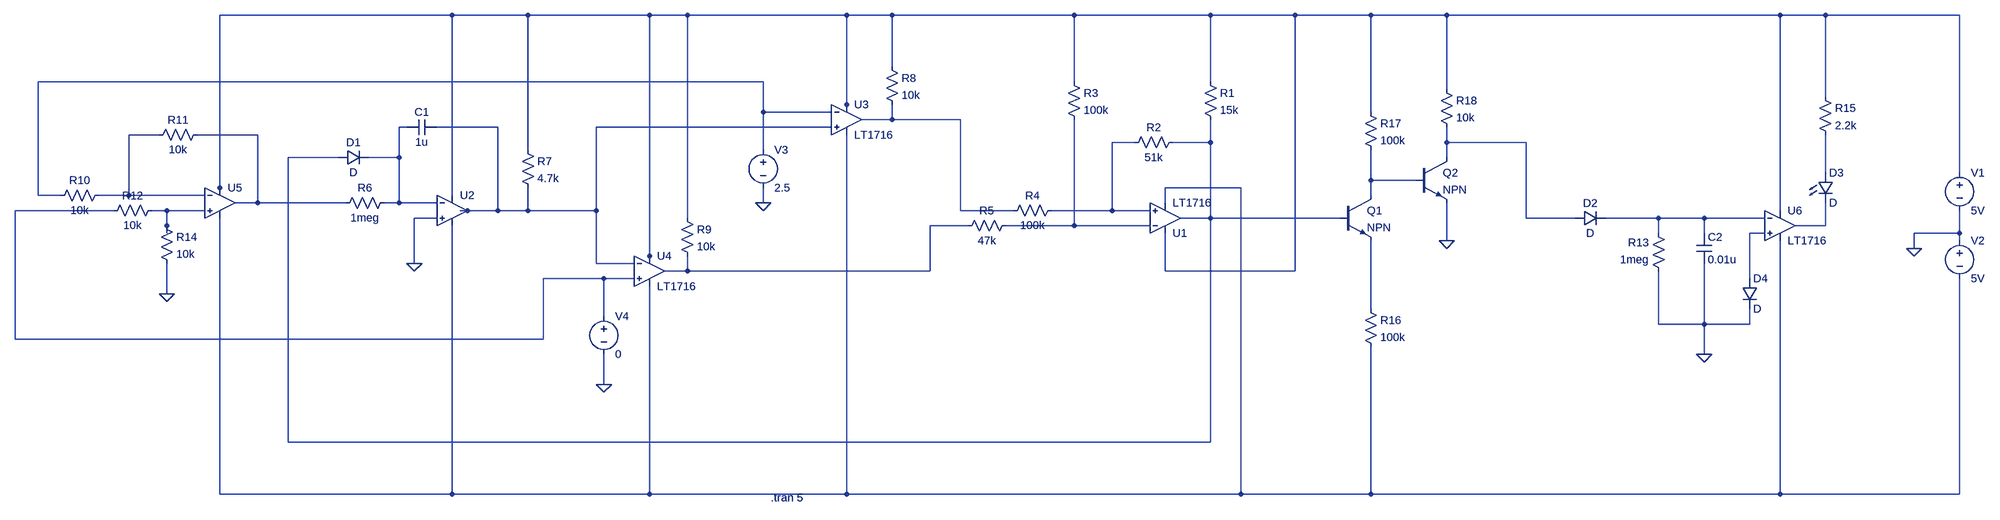
[diagram p0: schematic Sweep Generator.asc]
Sweep Generator.asc, the LTspice schematic file:
Version 4
SHEET 1 2540 920
WIRE -1040 -448 -1600 -448
WIRE -880 -448 -1040 -448
WIRE -624 -448 -880 -448
WIRE -544 -448 -624 -448
WIRE -208 -448 -544 -448
WIRE -112 -448 -208 -448
WIRE 272 -448 -112 -448
WIRE 560 -448 272 -448
WIRE 768 -448 560 -448
WIRE 928 -448 768 -448
WIRE 1088 -448 928 -448
WIRE 1936 -448 1088 -448
WIRE 2032 -448 1936 -448
WIRE 2480 -448 2032 -448
WIRE -112 -144 -112 -448
WIRE -384 -112 -1984 -112
WIRE 272 -112 272 -448
WIRE 560 -112 560 -448
WIRE 1088 -96 1088 -448
WIRE 2032 -80 2032 -448
WIRE -208 -64 -208 -448
WIRE -384 -48 -384 -112
WIRE -240 -48 -384 -48
WIRE -208 -48 -208 -64
WIRE 928 -48 928 -448
WIRE -112 -32 -112 -64
WIRE -112 -32 -176 -32
WIRE 32 -32 -112 -32
WIRE -1136 -16 -1152 -16
WIRE -944 -16 -1072 -16
WIRE -240 -16 -736 -16
WIRE -1728 0 -1792 0
WIRE -1520 0 -1648 0
WIRE 400 16 352 16
WIRE 560 16 560 -32
WIRE 560 16 480 16
WIRE 1088 16 1088 -16
WIRE 1312 16 1088 16
WIRE -880 32 -880 -448
WIRE -384 32 -384 -48
WIRE -1280 48 -1456 48
WIRE -1152 48 -1152 -16
WIRE -1152 48 -1216 48
WIRE 1088 48 1088 16
WIRE 2032 80 2032 0
WIRE 2480 80 2480 -448
WIRE 928 96 928 32
WIRE 1024 96 928 96
WIRE -1600 112 -1600 -448
WIRE 624 112 464 112
WIRE -1984 128 -1984 -112
WIRE -1936 128 -1984 128
WIRE -1792 128 -1792 0
WIRE -1792 128 -1856 128
WIRE -1632 128 -1792 128
WIRE -1600 128 -1600 112
WIRE -1040 128 -1040 -448
WIRE 928 128 928 96
WIRE -1520 144 -1520 0
WIRE -1520 144 -1568 144
WIRE -1264 144 -1520 144
WIRE -1152 144 -1152 48
WIRE -1152 144 -1184 144
WIRE -1072 144 -1152 144
WIRE -384 144 -384 112
WIRE 464 144 464 112
WIRE -1824 160 -2032 160
WIRE -1712 160 -1744 160
WIRE -1632 160 -1712 160
WIRE -1008 160 -1024 160
WIRE -944 160 -944 -16
WIRE -944 160 -1008 160
WIRE -880 160 -880 112
WIRE -880 160 -944 160
WIRE -736 160 -736 -16
WIRE -736 160 -880 160
WIRE 32 160 32 -32
WIRE 144 160 32 160
WIRE 352 160 352 16
WIRE 352 160 224 160
WIRE 432 160 352 160
WIRE 1936 160 1936 -448
WIRE -1072 176 -1120 176
WIRE -544 176 -544 -448
WIRE 560 176 560 16
WIRE 560 176 496 176
WIRE 864 176 560 176
WIRE 1312 176 1312 16
WIRE 1504 176 1312 176
WIRE 1680 176 1568 176
WIRE 1776 176 1680 176
WIRE 1904 176 1776 176
WIRE -1712 192 -1712 160
WIRE 48 192 -32 192
WIRE 272 192 272 -32
WIRE 272 192 128 192
WIRE 432 192 272 192
WIRE 2032 192 2032 144
WIRE 2032 192 1968 192
WIRE -1712 208 -1712 192
WIRE 1680 208 1680 176
WIRE 1776 208 1776 176
WIRE 1904 208 1872 208
WIRE 2480 208 2480 160
WIRE 2480 208 2384 208
WIRE 1088 224 1088 144
WIRE 2480 224 2480 208
WIRE 2384 240 2384 208
WIRE -624 256 -624 -448
WIRE -1120 272 -1120 176
WIRE -736 272 -736 160
WIRE -656 272 -736 272
WIRE -624 272 -624 256
WIRE -544 288 -544 256
WIRE -544 288 -592 288
WIRE -32 288 -32 192
WIRE -32 288 -544 288
WIRE 464 288 464 208
WIRE 768 288 768 -448
WIRE 768 288 464 288
WIRE -720 304 -848 304
WIRE -656 304 -720 304
WIRE 1872 304 1872 208
WIRE -1712 336 -1712 272
WIRE 928 368 928 224
WIRE -720 384 -720 304
WIRE 1680 400 1680 288
WIRE 1776 400 1776 272
WIRE 1776 400 1680 400
WIRE 1872 400 1872 368
WIRE 1872 400 1776 400
WIRE -2032 432 -2032 160
WIRE -848 432 -848 304
WIRE -848 432 -2032 432
WIRE 1776 464 1776 400
WIRE -720 528 -720 464
WIRE -1456 688 -1456 48
WIRE 560 688 560 176
WIRE 560 688 -1456 688
WIRE -1600 896 -1600 176
WIRE -1040 896 -1040 192
WIRE -1040 896 -1600 896
WIRE -624 896 -624 320
WIRE -624 896 -1040 896
WIRE -208 896 -208 0
WIRE -208 896 -624 896
WIRE 624 896 624 112
WIRE 624 896 -208 896
WIRE 928 896 928 448
WIRE 928 896 624 896
WIRE 1936 896 1936 224
WIRE 1936 896 928 896
WIRE 2480 896 2480 304
WIRE 2480 896 1936 896
FLAG 2384 240 0
FLAG -384 144 0
FLAG -720 528 0
FLAG -1120 272 0
FLAG -1712 336 0
FLAG 1088 224 0
FLAG 1776 464 0
SYMBOL voltage 2480 64 R0
WINDOW 123 0 0 Left 0
WINDOW 39 0 0 Left 0
SYMATTR InstName V1
SYMATTR Value 5V
SYMBOL voltage 2480 208 R0
WINDOW 123 0 0 Left 0
WINDOW 39 0 0 Left 0
SYMATTR InstName V2
SYMATTR Value 5V
SYMBOL res 544 -128 R0
SYMATTR InstName R1
SYMATTR Value 15k
SYMBOL res 240 144 R90
WINDOW 0 0 56 VBottom 0
WINDOW 3 32 56 VTop 0
SYMATTR InstName R4
SYMATTR Value 100k
SYMBOL res 144 176 R90
WINDOW 0 0 56 VBottom 0
WINDOW 3 32 56 VTop 0
SYMATTR InstName R5
SYMATTR Value 47k
SYMBOL res 496 0 R90
WINDOW 0 0 56 VBottom 0
WINDOW 3 32 56 VTop 0
SYMATTR InstName R2
SYMATTR Value 51k
SYMBOL res 256 -128 R0
SYMATTR InstName R3
SYMATTR Value 100k
SYMBOL Comparators\\LT1716 464 176 M180
SYMATTR InstName U1
SYMBOL res -1168 128 R90
WINDOW 0 0 56 VBottom 0
WINDOW 3 32 56 VTop 0
SYMATTR InstName R6
SYMATTR Value 1meg
SYMBOL cap -1072 -32 R90
WINDOW 0 0 32 VBottom 0
WINDOW 3 32 32 VTop 0
SYMATTR InstName C1
SYMATTR Value 1u
SYMBOL res -896 16 R0
SYMATTR InstName R7
SYMATTR Value 4.7k
SYMBOL Comparators\\LT1716 -208 -32 R0
SYMATTR InstName U3
SYMBOL Comparators\\LT1716 -624 288 R0
SYMATTR InstName U4
SYMBOL res -128 -160 R0
SYMATTR InstName R8
SYMATTR Value 10k
SYMBOL res -560 160 R0
SYMATTR InstName R9
SYMATTR Value 10k
SYMBOL voltage -384 16 R0
WINDOW 123 0 0 Left 0
WINDOW 39 0 0 Left 0
SYMATTR InstName V3
SYMATTR Value 2.5
SYMBOL voltage -720 368 R0
WINDOW 123 0 0 Left 0
WINDOW 39 0 0 Left 0
SYMATTR InstName V4
SYMATTR Value 0
SYMBOL Opamps\\UniversalOpamp2 -1600 144 R0
SYMATTR InstName U5
SYMBOL res -1840 112 R90
WINDOW 0 0 56 VBottom 0
WINDOW 3 32 56 VTop 0
SYMATTR InstName R10
SYMATTR Value 10k
SYMBOL res -1632 -16 R90
WINDOW 0 0 56 VBottom 0
WINDOW 3 32 56 VTop 0
SYMATTR InstName R11
SYMATTR Value 10k
SYMBOL res -1728 144 R90
WINDOW 0 0 56 VBottom 0
WINDOW 3 32 56 VTop 0
SYMATTR InstName R12
SYMATTR Value 10k
SYMBOL Opamps\\UniversalOpamp2 -1040 160 R0
SYMATTR InstName U2
SYMBOL res -1728 176 R0
SYMATTR InstName R14
SYMATTR Value 10k
SYMBOL diode -1280 32 M90
WINDOW 0 0 32 VBottom 0
WINDOW 3 32 32 VTop 0
SYMATTR InstName D1
SYMBOL Comparators\\LT1716 1936 192 R0
SYMATTR InstName U6
SYMBOL cap 1760 208 R0
SYMATTR InstName C2
SYMATTR Value 0.01u
SYMBOL res 1696 304 R180
WINDOW 0 36 76 Left 0
WINDOW 3 36 40 Left 0
SYMATTR InstName R13
SYMATTR Value 1meg
SYMBOL res 2016 -96 R0
SYMATTR InstName R15
SYMATTR Value 2.2k
SYMBOL LED 2016 80 R0
SYMATTR InstName D3
SYMBOL diode 1504 160 M90
WINDOW 0 0 32 VBottom 0
WINDOW 3 32 32 VTop 0
SYMATTR InstName D2
SYMBOL diode 1856 304 R0
SYMATTR InstName D4
SYMBOL res 912 352 R0
SYMATTR InstName R16
SYMATTR Value 100k
SYMBOL res 912 -64 R0
SYMATTR InstName R17
SYMATTR Value 100k
SYMBOL npn 864 128 R0
SYMATTR InstName Q1
SYMBOL npn 1024 48 R0
SYMATTR InstName Q2
SYMBOL res 1072 -112 R0
SYMATTR InstName R18
SYMATTR Value 10k
TEXT -368 904 Left 0 !.tran 5

The netlist it stands for:
* Sweep Generator.asc
V1 N001 0 5V
V2 0 N013 5V
R1 N001 N009 15k
R4 N008 N003 100k
R5 N018 N017 47k
R2 N009 N008 51k
R3 N001 N018 100k
XU1 N008 N018 N001 N013 N009 LT1716  ; pins In+ In- V+ V- OUT
R6 N004 N007 1meg
C1 N005 N004 1u
R7 N001 N005 4.7k
XU3 N005 N002 N001 N013 N003 LT1716  ; pins In+ In- V+ V- OUT
XU4 N014 N005 N001 N013 N017 LT1716  ; pins In+ In- V+ V- OUT
R8 N001 N003 10k
R9 N001 N017 10k
V3 N002 0 2.5
V4 N014 0 0
XU5 N015 N006 N001 N013 N007 level.2 Avol=1Meg GBW=10Meg Slew=10Meg ilimit=25m rail=0 Vos=0 phimargin=45 en=0 enk=0 in=0 ink=0 Rin=500Meg  ; pins IN+ IN- V+ V- OUT
R10 N006 N002 10k
R11 N007 N006 10k
R12 N015 N014 10k
XU2 0 N004 N001 N013 N005 level.2 Avol=1Meg GBW=10Meg Slew=10Meg ilimit=25m rail=0 Vos=0 phimargin=45 en=0 enk=0 in=0 ink=0 Rin=500Meg  ; pins IN+ IN- V+ V- OUT
R14 N015 0 10k
D1 N009 N004 D
XU6 N020 N016 N001 N013 N019 LT1716  ; pins In+ In- V+ V- OUT
C2 N016 0 0.01u
R13 0 N016 1meg
R15 N001 N011 2.2k
D3 N011 N019 D
D2 N010 N016 D
D4 N020 0 D
R16 N021 N013 100k
R17 N001 N012 100k
Q1 N012 N009 N021 0 NPN
Q2 N010 N012 0 0 NPN
R18 N001 N010 10k
.model D D
.lib standard.dio
.model NPN NPN
.model PNP PNP
.lib standard.bjt
.tran 5
.lib LTC1.lib
.lib UniversalOpamps2.sub
.backanno
.end